# Altium schematic sheet RpiPaw1_Sch.SchDoc
size A
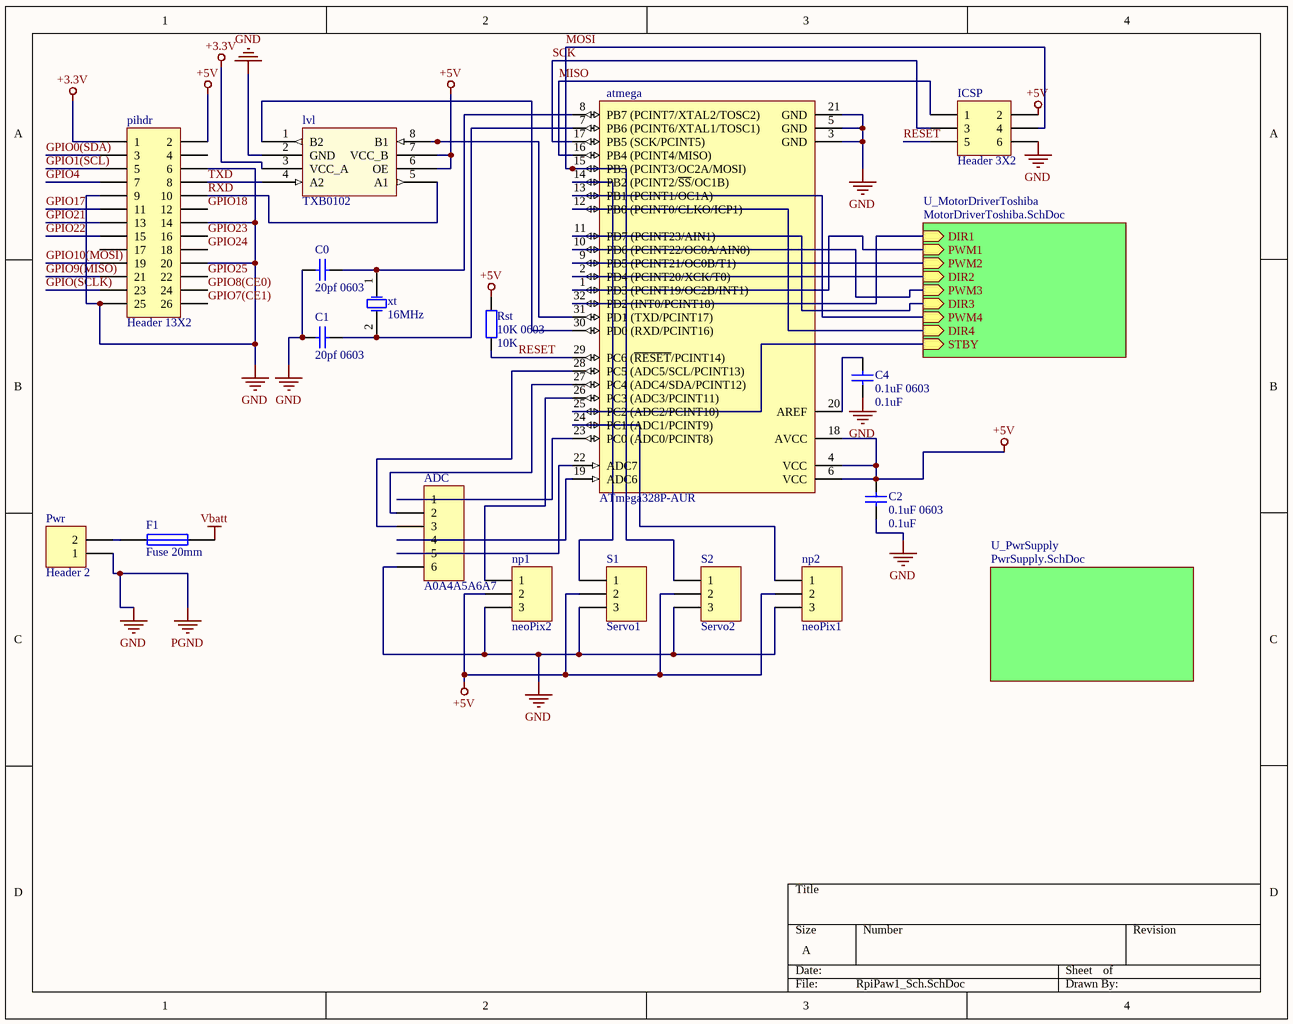
[diagram p0: RpiPaw1_Sch.SchDoc]

## Parts
ADC  A0A4A5A6A7  [HDR1X6]
atmega  ATmega328P-AUR  [TQFP32_N]
C0  20pf 0603  [J1-0603]
C1  20pf 0603  [J1-0603]
C2  0.1uF 0603  value 0.1uF  [J1-0603]
C4  0.1uF 0603  value 0.1uF  [J1-0603]
F1  Fuse 20mm  [FusePad1]
ICSP  Header 3X2  [HDR2X3]
lvl  TXB0102  [TSSOP50P310X90-8N]
np1  neoPix2  [HDR1X3]
np2  neoPix1  [HDR1X3]
pihdr  Header 13X2  [HDR2X13]
Pwr  Header 2  [PwrPlug1]
Rst  10K 0603  value 10K  [J1-0603]
S1  Servo1  [HDR1X3]
S2  Servo2  [HDR1X3]
xt  16MHz  [Axial 0.2]

## Sub-sheets
U_MotorDriverToshiba = MotorDriverToshiba.SchDoc: DIR1 (in), PWM1 (in), PWM2 (in), DIR2 (in), PWM3 (in), DIR3 (in), PWM4 (in), DIR4 (in), STBY (in)
U_PwrSupply = PwrSupply.SchDoc: no entries

## Nets
+3.3V: lvl.3(VCC_A) pihdr.1
+5V: atmega.4(VCC) atmega.6(VCC) atmega.18(AVCC) C2.2 ICSP.2 lvl.6(OE) lvl.7(VCC_B) np1.2 np2.2 pihdr.2 Rst.2 S1.2 S2.2
GND: ADC.6 atmega.3(GND) atmega.5(GND) atmega.21(GND) C0.1 C1.1 C2.1 C4.1 ICSP.6 lvl.2(GND) np1.3 np2.3 pihdr.6 pihdr.9 pihdr.14 pihdr.20 pihdr.25 Pwr.1 S1.3 S2.3  [also labelled PGND]
Vbatt: F1.2
GPIO0(SDA): pihdr.3
GPIO1(SCL): pihdr.5
GPIO4: pihdr.7
GPIO7(CE1): pihdr.26
GPIO8(CE0): pihdr.24
GPIO9(MISO): pihdr.21
GPIO10(MOSI): pihdr.19
GPIO17: pihdr.11
GPIO18: pihdr.12
GPIO21: pihdr.13
GPIO22: pihdr.15
GPIO23: pihdr.16
GPIO24: pihdr.18
GPIO25: pihdr.22
GPIO(SCLK): pihdr.23
MISO: atmega.16(PB4_(PCINT4/MISO)) ICSP.1
MOSI: atmega.15(PB3_(PCINT3/OC2A/MOSI)) ICSP.4 S2.1
RESET: atmega.29(PC6_(~{RESET}/PCINT14)) ICSP.5 Rst.1
RXD: lvl.5(A1) pihdr.10
SCK: atmega.17(PB5_(SCK/PCINT5)) ICSP.3
TXD: lvl.4(A2) pihdr.8
NetADC_1: ADC.1 atmega.23(PC0_(ADC0/PCINT8))
NetADC_2: ADC.2 atmega.27(PC4_(ADC4/SDA/PCINT12))
NetADC_3: ADC.3 atmega.28(PC5_(ADC5/SCL/PCINT13))
NetADC_4: ADC.4 atmega.19(ADC6)
NetADC_5: ADC.5 atmega.22(ADC7)
Netatmega_1: atmega.1(PD3_(PCINT19/OC2B/INT1)) ; sheet U_MotorDriverToshiba/PWM1
Netatmega_2: atmega.2(PD4_(PCINT20/XCK/T0)) ; sheet U_MotorDriverToshiba/DIR2
Netatmega_7: atmega.7(PB6_(PCINT6/XTAL1/TOSC1)) C1.2 xt.2(OSC2)
Netatmega_8: atmega.8(PB7_(PCINT7/XTAL2/TOSC2)) C0.2 xt.1(OSC1)
Netatmega_9: atmega.9(PD5_(PCINT21/OC0B/T1)) ; sheet U_MotorDriverToshiba/PWM2
Netatmega_10: atmega.10(PD6_(PCINT22/OC0A/AIN0)) ; sheet U_MotorDriverToshiba/PWM3
Netatmega_11: atmega.11(PD7_(PCINT23/AIN1)) ; sheet U_MotorDriverToshiba/DIR3
Netatmega_12: atmega.12(PB0_(PCINT0/CLKO/ICP1)) ; sheet U_MotorDriverToshiba/DIR4
Netatmega_13: atmega.13(PB1_(PCINT1/OC1A)) ; sheet U_MotorDriverToshiba/PWM4
Netatmega_14: atmega.14(PB2_(PCINT2/~{SS}/OC1B)) S1.1
Netatmega_20: atmega.20(AREF) C4.2
Netatmega_24: atmega.24(PC1_(ADC1/PCINT9)) np2.1
Netatmega_25: atmega.25(PC2_(ADC2/PCINT10)) ; sheet U_MotorDriverToshiba/STBY
Netatmega_26: atmega.26(PC3_(ADC3/PCINT11)) np1.1
Netatmega_30: atmega.30(PD0_(RXD/PCINT16)) lvl.1(B2)
Netatmega_31: atmega.31(PD1_(TXD/PCINT17)) lvl.8(B1)
Netatmega_32: atmega.32(PD2_(INT0/PCINT18)) ; sheet U_MotorDriverToshiba/DIR1
NetF1_1: F1.1 Pwr.2

Not connected (* = marked no-connect by the designer): pihdr 4 17

## Library data of the parts
ADC = Header 6: Header, 6-Pin; LatestRevisionDate: 17-Jul-2002; LatestRevisionNote: Re-released for DXP Platform.; Publisher: Altium Limited
atmega = ATmega328P-AUR: 8-bit AVR Microcontroller, 32KB Flash, 1KB EEPROM, 2KB SRAM, 32-pin TQFP, Industrial Grade (-40°C to 85°C); Published: 1-Apr-2010; DatasheetVersion: revA, Jan-2010; PackageVersion: revB, Oct-2001; PackageReference: 32A; Publisher: Altium Limited; PackageDescription: 32-Lead, 7x7x1.0 mm Body, 0.8mm Lead Pitch, Thin Profile Plastic Quad Flat Package (TQFP); Supplier 1: Digi-Key; Supplier Part Number 1: ATMEGA328P-AUR-ND; Supplier 2: Mouser; Supplier Part Number 2: 556-ATMEGA328P-AUR; Code_JEDEC: MS-026-ABA; ComponentLink1Description: Manufacturer Link; ComponentLink1URL: http://www.atmel.com/products/avr/default.asp?; ComponentLink2Description: ATmega48A/48PA/88A/88PA/168A/168PA/328/328P Datasheet; ComponentLink2URL: http://www.atmel.com/dyn/resources/prod_documents/8271.pdf; ComponentLink3Description: ATmega48A/48PA/88A/88PA/168A/168PA/328/328P Summary; ComponentLink3URL: http://www.atmel.com/dyn/resources/prod_documents/8271S.pdf; ComponentLink4Description: Atmel.com Home; ComponentLink4URL: http://www.atmel.com
C0-C2 C4 = Cap: Capacitor; Published: 8-Jun-2000; LatestRevisionDate: 17-Jul-2002; LatestRevisionNote: Re-released for DXP Platform.; PackageReference: RAD-0.3; Publisher: Altium Limited
F1 = Fuse 1: Fuse; Published: 8-Jun-2000; LatestRevisionDate: 17-Jul-2002; LatestRevisionNote: Re-released for DXP Platform.; PackageReference: PIN-W2/E2.8; Publisher: Altium Limited
ICSP = Header 3X2: Header, 3-Pin, Dual row; LatestRevisionDate: 17-Jul-2002; LatestRevisionNote: Re-released for DXP Platform.; Publisher: Altium Limited
lvl = TXB0102: 3.3V Level translator
np1 np2 S1 S2 = Header 3: Header, 3-Pin; LatestRevisionDate: 17-Jul-2002; LatestRevisionNote: Re-released for DXP Platform.; Publisher: Altium Limited
pihdr = Header 13X2: Header, 13-Pin, Dual row; LatestRevisionDate: 17-Jul-2002; LatestRevisionNote: Re-released for DXP Platform.; Publisher: Altium Limited
Pwr = Header 2: Header, 2-Pin; LatestRevisionDate: 17-Jul-2002; LatestRevisionNote: Re-released for DXP Platform.; Publisher: Altium Limited
Rst = Res2: Resistor; Published: 8-Jun-2000; LatestRevisionDate: 17-Jul-2002; LatestRevisionNote: Re-released for DXP Platform.; PackageReference: AXIAL-0.4; Publisher: Altium Limited
xt = XTAL: Crystal Oscillator; Published: 8-Jun-2000; LatestRevisionDate: 17-Jul-2002; LatestRevisionNote: Re-released for DXP Platform.; PackageReference: R38; Publisher: Altium Limited